# Altium schematic sheet Radio.SchDoc
size A
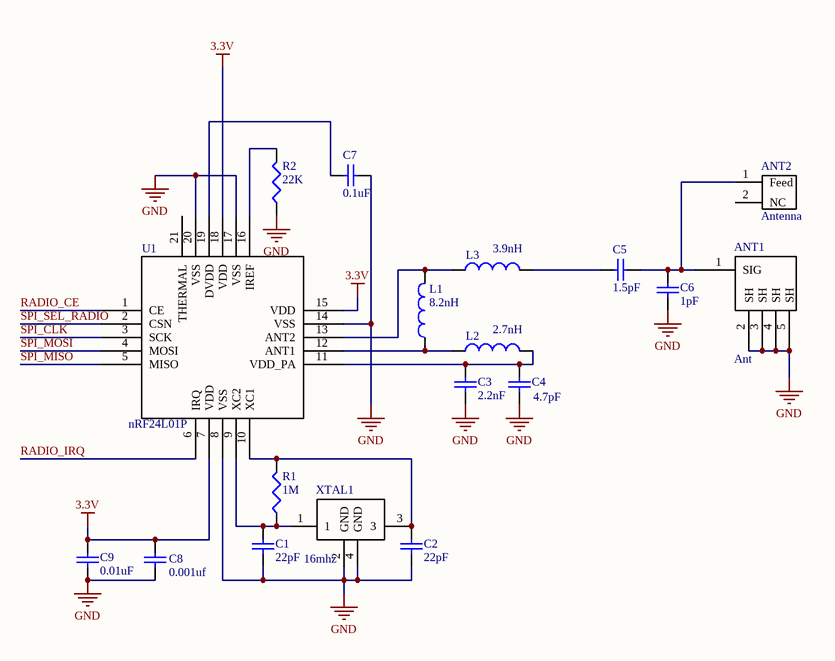
[diagram p0: Radio.SchDoc]

## Parts
ANT1  Ant  [AntennaSMA]
ANT2  Antenna  [antenna]
C1  value 22pF  [CAPC1005L]  (hidden comment: Cap Semi)
C2  value 22pF  [CAPC1005L]  (hidden comment: Cap Semi)
C3  value 2.2nF  [CAPC1005L]  (hidden comment: Cap Semi)
C4  value 4.7pF  [CAPC1005L]  (hidden comment: Cap Semi)
C5  value 1.5pF  [CAPC1005L]  (hidden comment: Cap Semi)
C6  value 1pF  [CAPC1005L]  (hidden comment: Cap Semi)
C7  value 0.1uF  [CAPC1005L]  (hidden comment: Cap Semi)
C8  value 0.001uf  [CAPC1005L]  (hidden comment: Cap Semi)
C9  value 0.01uF  [CAPC1005L]  (hidden comment: Cap Semi)
L1  value 8.2nH  [INDC1005AL]  (hidden comment: Inductor)
L2  value 2.7nH  [INDC1005AL]  (hidden comment: Inductor)
L3  value 3.9nH  [INDC1005AL]  (hidden comment: Inductor)
R1  value 1M  [RESC1608L]  (hidden comment: Res3)
R2  value 22K  [RESC1608L]  (hidden comment: Res3)
U1  nRF24L01P  [QFN-20]
XTAL1  value 16mhz  [RadioCrystal]  (hidden comment: RADIO CRYSTAL)

## Nets
3.3V: C8.2 C9.2 U1.7(VDD) U1.15(VDD) U1.18(VDD)
GND: ANT1.2(SH) ANT1.3(SH) ANT1.4(SH) ANT1.5(SH) C1.1 C2.1 C3.1 C4.1 C6.1 C7.1 C8.1 C9.1 R2.1 U1.8(VSS) U1.14(VSS) U1.17(VSS) U1.20(VSS) XTAL1.2(GND) XTAL1.4(GND)
RADIO_CE: U1.1(CE)
RADIO_IRQ: U1.6(IRQ)
SPI_CLK: U1.3(SCK)
SPI_MISO: U1.5(MISO)
SPI_MOSI: U1.4(MOSI)
SPI_SEL_RADIO: U1.2(CSN)
NetANT1_1: ANT1.1(SIG) ANT2.1(Feed) C5.1 C6.2
NetC1_2: C1.2 R1.1 U1.9(XC2) XTAL1.1
NetC2_2: C2.2 R1.2 U1.10(XC1) XTAL1.3
NetC3_2: C3.2 C4.2 L2.2 U1.11(VDD_PA)
NetC5_2: C5.2 L3.2
NetC7_2: C7.2 U1.19(DVDD)
NetL1_1: L1.1 L2.1 U1.12(ANT1)
NetL1_2: L1.2 L3.1 U1.13(ANT2)
NetR2_2: R2.2 U1.16(IREF)

Not connected (* = marked no-connect by the designer): ANT2 2(NC); U1 21(THERMAL)

## Library data of the parts
ANT1 = AntennaConn
C1-C9 = Cap Semi: Capacitor (Semiconductor SIM Model); Published: 8-Jun-2000; LatestRevisionDate: 29-May-2009; LatestRevisionNote: IPC-7351 Footprint Added.; PackageReference: C1206; Publisher: Altium Limited; PackageDescription: Chip Capacitor
L1-L3 = Inductor: Code_IEC: 1005; Published: 8-Jun-2000; LatestRevisionDate: 29-May-2009; LatestRevisionNote: IPC-7351 Footprint Added.; PackageReference: 0402-A; Publisher: Altium Limited; PackageDescription: Chip Inductor; Code_JEITA: 0402
R1 R2 = Res3: Resistor; Published: 8-Jun-2000; LatestRevisionDate: 29-May-2009; LatestRevisionNote: IPC-7351 Footprint Added.; PackageReference: J1-0603; Publisher: Altium Limited; PackageDescription: Chip Resistor
U1 = radio-nRF24L01P
XTAL1 = RadioCrystal